# EAGLE design lm3410-sepic-flashlight-driver-17mm-mk-1.0.0 (EAGLE 6.6.0)
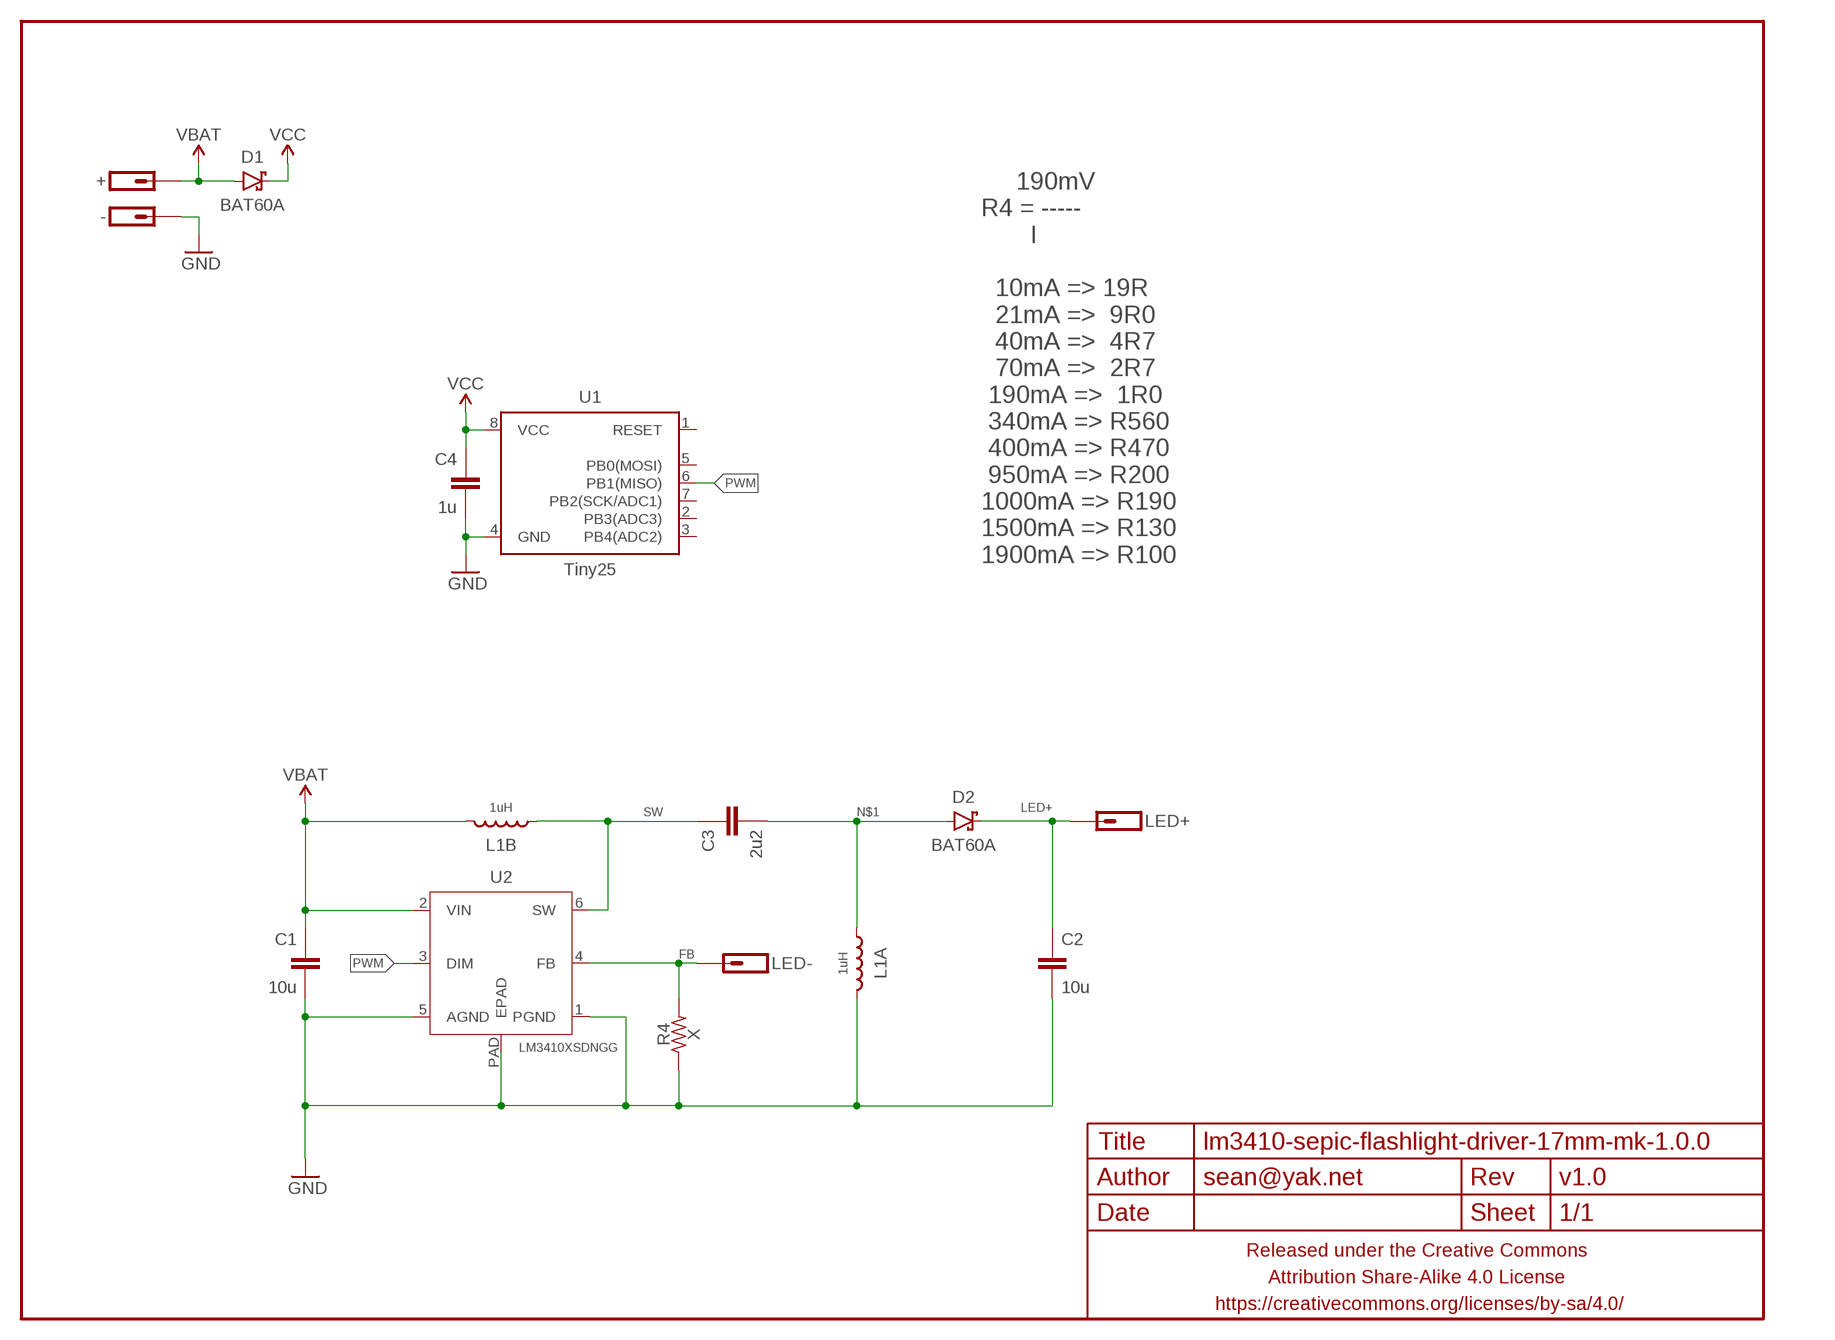
[diagram p0: schematic, sheet 1]

## Parts
+  M01NOT-A-VIA-NOPE  [1X01_NOSILK_NOSTOP]
-  M01NOT-A-VIA-NOPE  [1X01_NOSILK_NOSTOP]
C1  10u  CAPACITOR-CERAMICC0805-TIGHTER  [C0805-TIGHTER]
C2  10u  CAPACITOR-CERAMICC0805-TIGHTER  [C0805-TIGHTER]
C3  2u2  CAPACITOR-CERAMICC0603-TIGHTER  [C0603-TIGHTER]
C4  1u  CAPACITOR-CERAMICC0603-TIGHTER  [C0603-TIGHTER]
D1  BAT60A  DIODE-SCHOTTKYSOD323  [SOD323-SCHOTTKY]
D2  BAT60A  DIODE-SCHOTTKYSOD323  [SOD323-SCHOTTKY]
FRAME1  FRAME-LETTERNO_PACKAGE  [DUMMY]
L1  1uH  INDUCTOR-DUALCOILCRAFT-LPD5030  [LPD5030]
LED+  M01PTH-1MM-CIR-NS  [1X01-1MM-CIR-NS]
LED-  M01PTH-1MM-CIR-NS  [1X01-1MM-CIR-NS]
R4  X  RESISTORR0805-TIGHTER  [R0805-TIGHTER]
U1  Tiny25  ATTINY45TINY25-SOICN-NARROWER  [SO08-SKINNYPADS]
U2  LM3410XSDNGG  [DFN300X300X80-7N]

## Nets
FB: LED-.1 R4.2 U2.4(FB)
GND: -.P$1 C1.2 C2.2 C4.2 L1.2 R4.1 U1.4(GND) U2.1(PGND) U2.5(AGND) U2.PAD(EPAD)
LED+: C2.1 D2.C LED+.1
N$1: C3.2 D2.A L1.1
PWM: U1.6(PB1(MISO)) U2.3(DIM)
SW: C3.1 L1.4 U2.6(SW)
VBAT: +.P$1 C1.1 D1.A L1.3 U2.2(VIN)
VCC: C4.1 D1.C U1.8(VCC)
Unconnected: U1.1(RESET) U1.2(PB3(ADC3)) U1.3(PB4(ADC2)) U1.5(PB0(MOSI)) U1.7(PB2(SCK/ADC1))

## Notes on the sheet
- 190mV
  R4 = -----
         I
  
    10mA => 19R
    21mA =>  9R0
    40mA =>  4R7
    70mA =>  2R7
   190mA =>  1R0
   340mA => R560
   400mA => R470
   950mA => R200
  1000mA => R190
  1500mA => R130
  1900mA => R100

## Library data of the parts
+ - LED+ LED- = a_parts:M01: Header 1 Standard 1-pin 0.1" header. Use with straight break away headers (SKU : PRT-00116), right angle break away headers (PRT-00553), swiss pins (PRT-00743), machine pins (PRT-00117), and female headers (PRT-00115).
C1-C4 = a_parts:CAPACITOR-CERAMIC: CAPACITOR, European symbol
D1 D2 = a_parts:DIODE-SCHOTTKY: Schottky diodes in SFE's production catalog BAT20J 1A 23V 0.62Vf RB751 120mA 40V 0.37Vf PMEG4005EJ 0.5A 40V 0.42Vf MBRA140 1A 40V 0.5Vf B340A 3A 40V SMA
FRAME1 = a_parts:FRAME-LETTER: Schematic Frame Standard 8.5x11 US Letter frame; DESIGNER: sean@yak.net; VERSION: v1.0
L1 = a_parts:INDUCTOR-DUAL
R4 = a_parts:RESISTOR: RESISTOR, American symbol
U1 = a_parts:ATTINY45: Atmel 8-pin 2/4/8kB flash uC
U2 = a_parts:LM3410XSD: Constant Current Boost and SEPIC LED Driver; MPN: LM3410XSD; OC_FARNELL: -; OC_NEWARK: 11N9218; PACKAGE: DFN-6; SUPPLIER: National Semiconductor

## Board
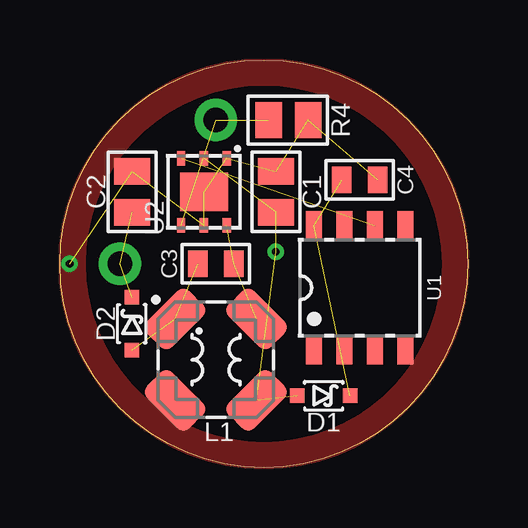
[diagram p1: board, top side]
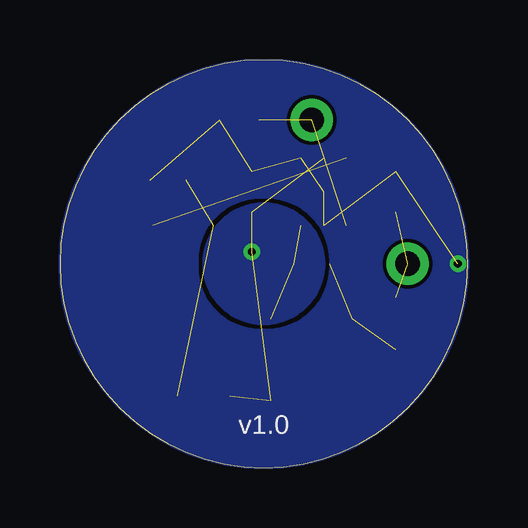
[diagram p2: board, bottom side, seen from below]

Size 17 x 17 mm. Coordinates in mm from the lower left corner, seen from the top.
Outline: 0,8.5 arc-180 17,8.5 arc-180 0,8.5
Copper layers (1*16): Top 0.0356mm / dielectric 1.5011mm / Bottom 0.0356mm
Design rules "LaenPCBOrder2 *": minimum track width 6mil, minimum drill 13mil, track to track 6mil, track to pad 6mil, pad to pad 6mil, via to via 6mil, smd to smd 6mil, copper to edge 0mil, drill to drill 6mil, minimum pad ring 7mil, minimum via ring 7mil, stop-mask expansion 3mil, vias tented up to drill 20mil, thermal gap 10mil

### Footprints (pad centres in the part's own frame; a part is rotated, then mirrored left to right if it is on the bottom)
1X01_NOSILK_NOSTOP = drill 0.33: P$1 0,0
C0805-TIGHTER = smd 1.1 x 1.5: 1 -0.85,0; 2 0.85,0
C0603-TIGHTER = smd 0.8 x 1.1: 1 -0.75,0; 2 0.75,0
SOD323-SCHOTTKY = smd 0.6 x 0.6: A -1.1,0; C 1.1,0
LPD5030 = smd 2.5 x 1.5 rotated 45: 1 -1.7,1.7 | smd 2.5 x 1.5 rotated 135: 2 -1.7,-1.7 | smd 2.5 x 1.5 rotated 225: 3 1.7,-1.7 | smd 2.5 x 1.5 rotated 315: 4 1.7,1.7
1X01-1MM-CIR-NS = drill 1.016 pad 1.778: 1 0,0
R0805-TIGHTER = smd 1.1 x 1.5: 1 -0.85,0; 2 0.8,0
SO08-SKINNYPADS = smd 0.65 x 1.2: 1 -1.905,-2.6; 2 -0.635,-2.6; 3 0.635,-2.6; 4 1.905,-2.6; 5 1.905,2.6; 6 0.635,2.6; 7 -0.635,2.6; 8 -1.905,2.6
DFN300X300X80-7N = smd 0.6 x 0.35: 1 -1.4,0.95; 2 -1.4,0; 3 -1.4,-0.95; 4 1.4,-0.95; 5 1.4,0; 6 1.4,0.95 | smd 1.6 x 2: PAD 0,0

### Placement (x,y rotation side)
+  9,9 180 top
-  0.4,8.5 90 bottom
C1  9,11.5 90 top
C2  3,11.5 90 top
C3  6.5,8.5 180 top
C4  12.5,12 0 top
D1  11,3 0 top
D2  3,6 90 top
FRAME1  0,0 0 top
L1  6.5,4.5 0 top
LED+  2.5,8.5 270 top
LED-  6.5,14.5 180 top
R4  9.5,14.5 180 top
U1  12.5,7.5 0 top
U2  6,11.5 270 top

### Tracks (layer width: path | path; a pad name or v marks a point on that pad's centre or on a via)
FB  (2 unrouted)
GND  (7 unrouted)
  pour Top (isolate 0.152, rank 6, no thermals): 0,8.5 arc90 8.5,0 arc90 17,8.5 16,8.5 arc-90 8.5,1 arc-90 1,8.5
  pour Bottom (isolate 0.152, rank 6, no thermals): 8.5,0 arc-90 0,8.5 arc-90 8.5,17 arc-90 17,8.5 arc-90
  pour Top (isolate 0.152, rank 6, no thermals): 17,8.5 arc90 8.5,17 arc90 0,8.5 1,8.5 arc-90 8.5,16 arc-90 16,8.5
LED+  (2 unrouted)
N$1  (2 unrouted)
PWM  (1 unrouted)
SW  (2 unrouted)
VBAT  (4 unrouted)
  pour Bottom (isolate 0.152, no thermals): 6,8.5 arc-180 11,8.5 arc-180
VCC  (2 unrouted)

### Text on the board
bPlace: LM3410 / Boost Driver